# Altium schematic sheet QCopterRC_CAMSPI_Sch.SchDoc
size A4
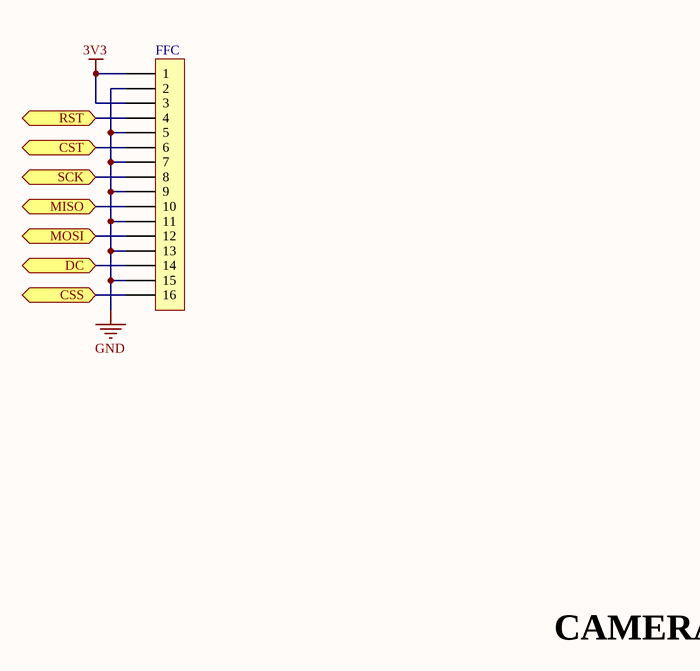
[diagram p0: QCopterRC_CAMSPI_Sch.SchDoc]

## Parts
FFC  FFC_0.5_16  [FFC_0.5_16]  (value not drawn)

## Ports
CSS, CST, DC, MISO, MOSI, RST, SCK

## Nets
3V3: FFC.1 FFC.3
GND: FFC.2 FFC.5 FFC.7 FFC.9 FFC.11 FFC.13 FFC.15
CSS: FFC.16 ; port CSS
CST: FFC.6 ; port CST
DC: FFC.14 ; port DC
MISO: FFC.10 ; port MISO
MOSI: FFC.12 ; port MOSI
RST: FFC.4 ; port RST
SCK: FFC.8 ; port SCK

## Notes on the sheet
- CAMERA

## Library data of the parts
FFC = FFC_0.5_16: FFC